# EAGLE design reflow_shield (EAGLE 5.06)
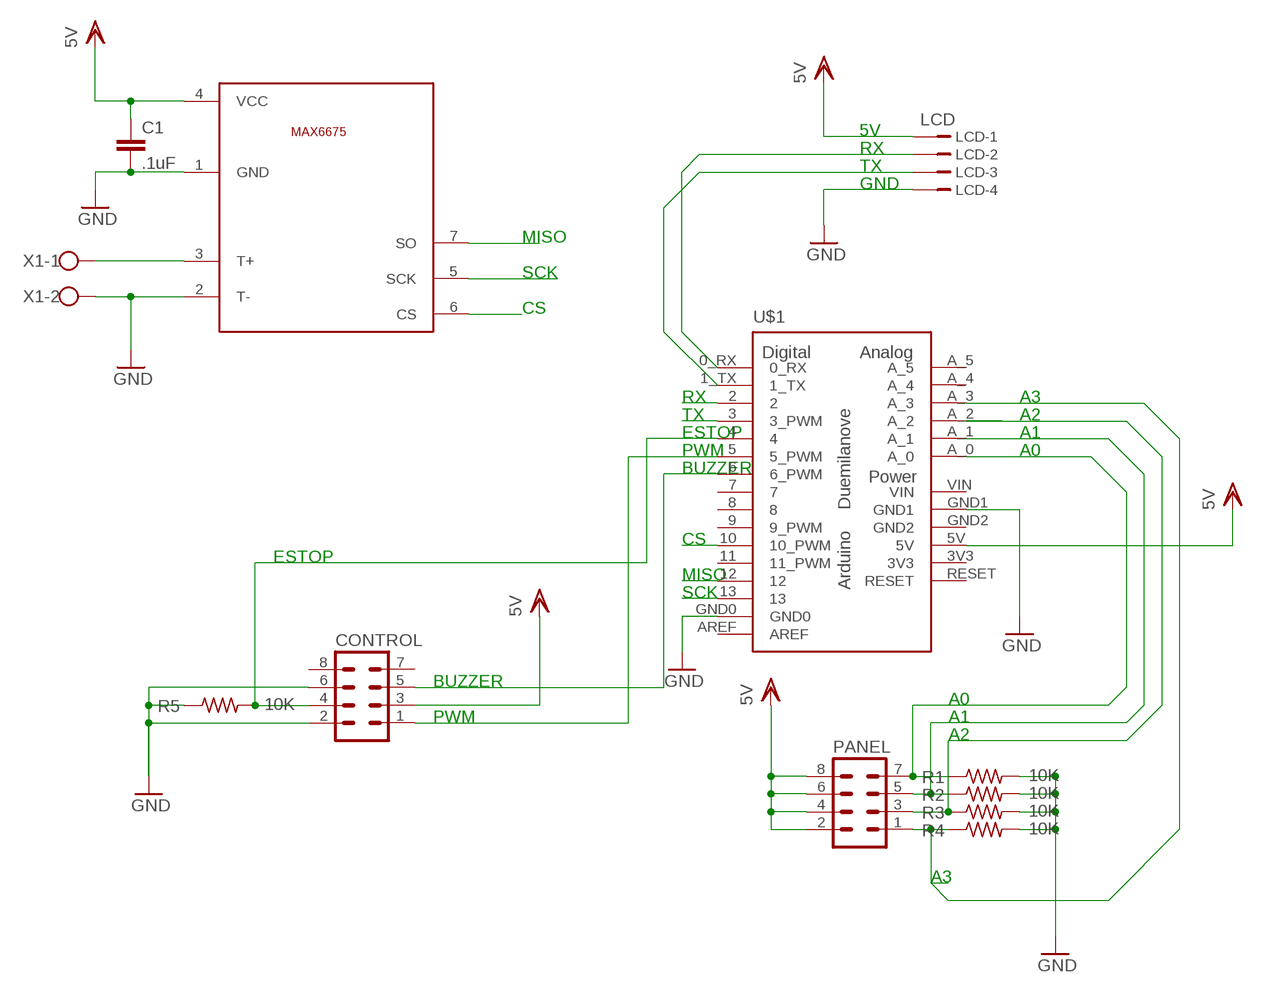
[diagram p0: schematic, sheet 1]

## Parts
C1  .1uF  C-EUC0805  [C0805]
CONTROL  MA04-2  [MA04-2]
LCD  LCD  B4B-ZR  [B4B-ZR]
PANEL  MA04-2  [MA04-2]
R1  10K  R-US_M0805  [M0805]
R2  10K  R-US_M0805  [M0805]
R3  10K  R-US_M0805  [M0805]
R4  10K  R-US_M0805  [M0805]
R5  10K  R-US_M0805  [M0805]
U$1  ARDUINO-USBLONG_PADS_TEXT  [SHIELD]
U$2  MAX6676ISA  [SO8]
X1  W237-102  [W237-102]

## Nets
A0: PANEL.7 R1.1 U$1.A_0
A1: PANEL.5 R2.1 U$1.A_1
A2: PANEL.3 R3.1 U$1.A_2
A3: PANEL.1 R4.1 U$1.A_3
BUZZER: CONTROL.5 U$1.6(6_PWM)
CS: U$1.10(10_PWM) U$2.6(CS)
ESTOP: CONTROL.4 R5.2 U$1.4
GND: C1.2 CONTROL.2 CONTROL.6 LCD.4 R1.2 R2.2 R3.2 R4.2 R5.1 U$1.GND0 U$2.1(GND) U$2.2(T-) X1.2
GND1: U$1.GND1 ; supply symbol labelled GND
MISO: U$1.12 U$2.7(SO)
N$3: U$2.3(T+) X1.1
PWM: CONTROL.1 U$1.5(5_PWM)
RX: LCD.2 U$1.0_RX U$1.2
SCK: U$1.13 U$2.5(SCK)
TX: LCD.3 U$1.1_TX U$1.3(3_PWM)
VDD: C1.1 CONTROL.3 LCD.1 PANEL.2 PANEL.4 PANEL.6 PANEL.8 U$1.5V U$2.4(VCC) ; supply symbol labelled 5V
Unconnected: CONTROL.7 CONTROL.8 U$1.7 U$1.8 U$1.9(9_PWM) U$1.11(11_PWM) U$1.A_4 U$1.A_5 U$1.AREF U$1.GND2 U$1.RESET

## Notes on the sheet
- 5V
- RX
- TX
- GND
- MISO
- SCK
- CS
- RX | A3
- TX | A2
- ESTOP | A1
- PWM | A0
- BUZZER
- CS
- ESTOP
- MISO
- SCK
- BUZZER
- A0
- PWM | A1
- A2
- A3

## Power pins joined to a net without a drawn wire
3V3: U$1.3V3
VIN: U$1.VIN

## Library data of the parts
C1 = rcl:C-EU: CAPACITOR, European symbol
CONTROL PANEL = con-lstb:MA04-2: PIN HEADER
LCD = con-jst:?4B-ZR: ZH CONNECTOR 1.5 mm, 4 pin 1 row Source: http://www.jst.com .. eZH.pdf
R1-R5 = rcl:R-US_: RESISTOR, American symbol
U$1 = Arduino-Various:ARDUINO-USB: The Ardiuno Duemilanove Pinouts layoutet as a Bare Shield. v0.5 Also for Arduino Diecimila. This is designed as a Part and has no Outline in the Dimension Layer. The Outline, when present, is drawed at the tPlace / bPlace Layer. Library by Stephanie Lange, http://www.k-ita.de/~sl/
U$2 = reflowparts:MAX6676ISA
X1 = con-wago-500:W237-102: WAGO SCREW CLAMP

## Board
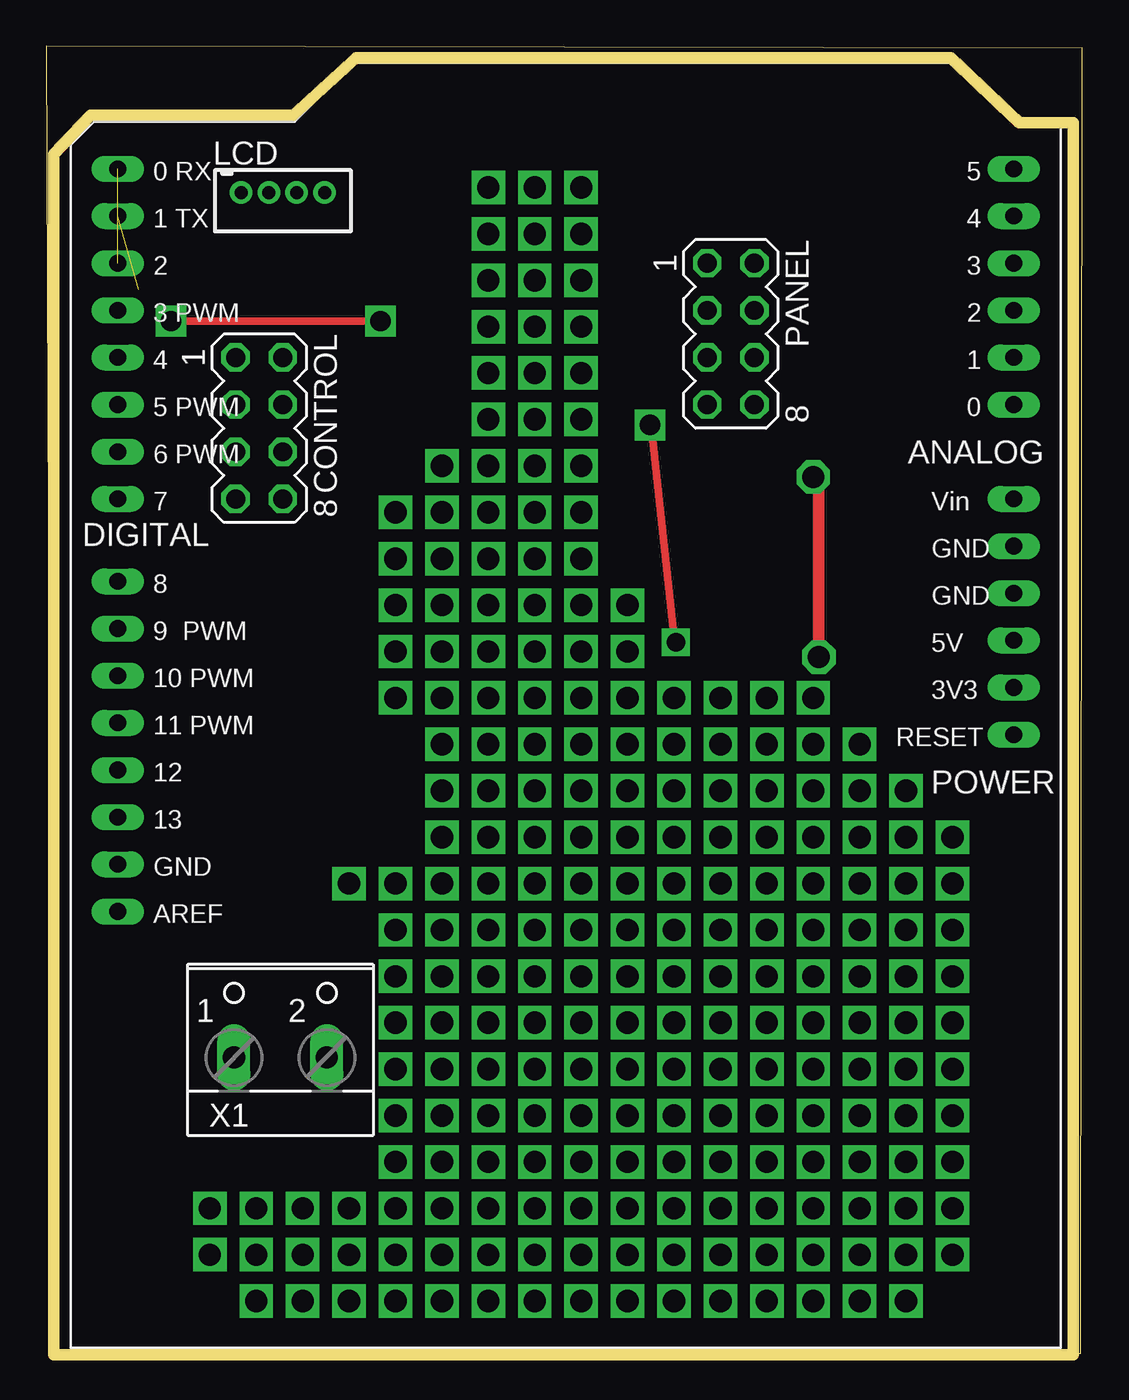
[diagram p1: board, top side]
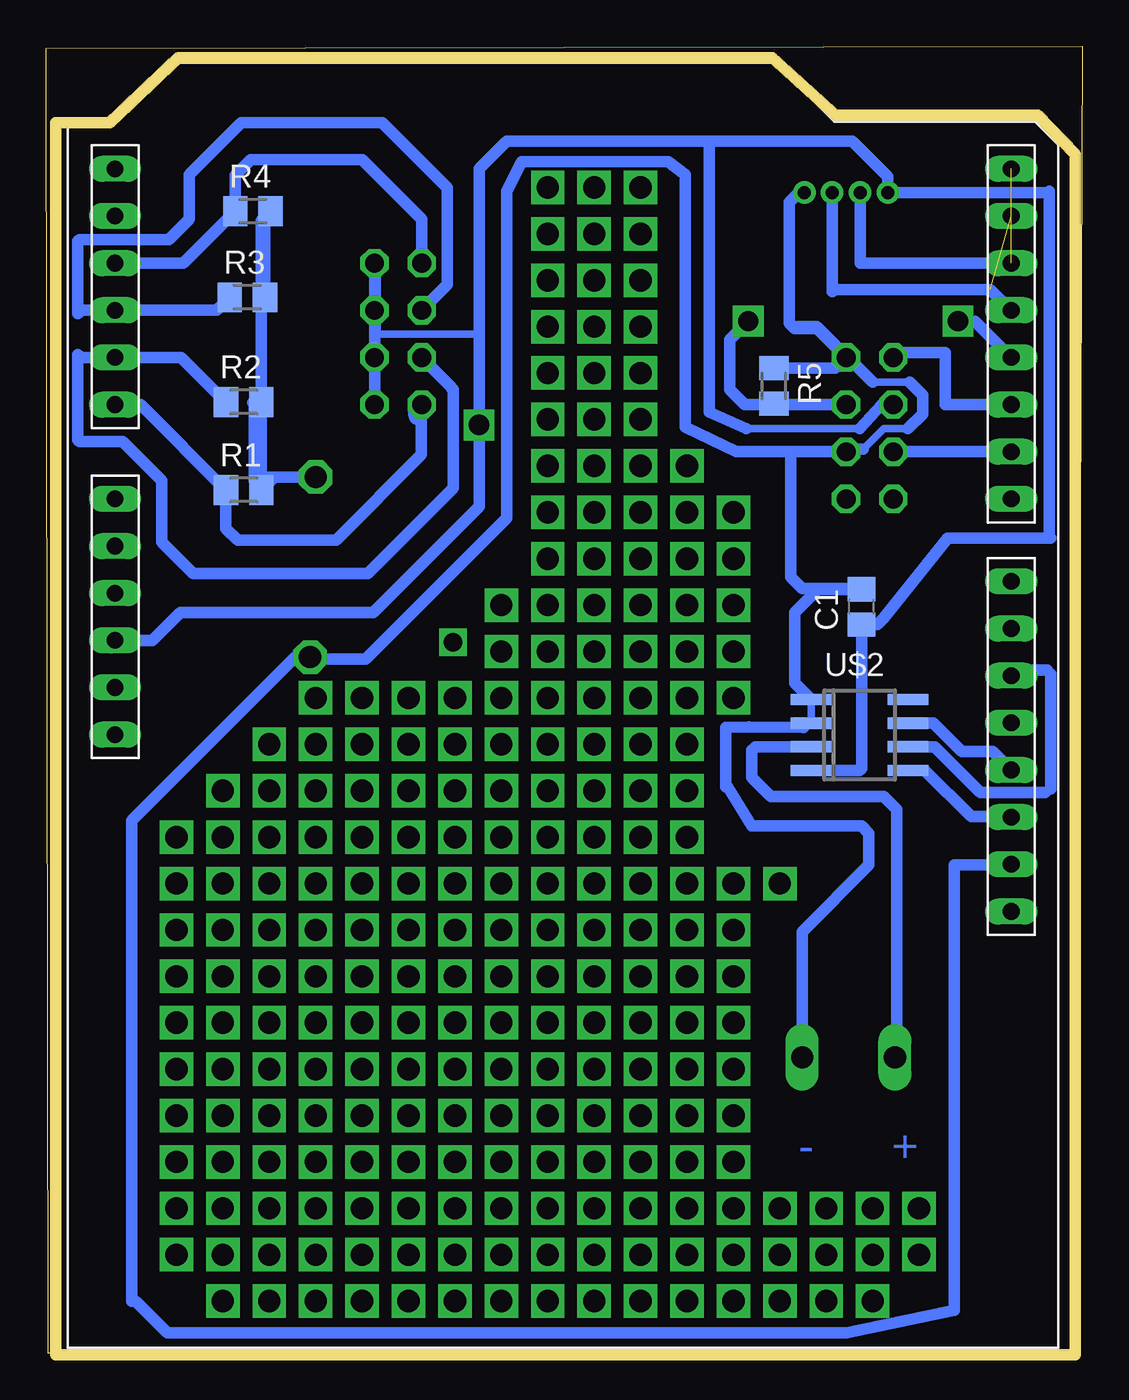
[diagram p2: board, bottom side, seen from below]

Size 55.8 x 70.4 mm. Coordinates in mm from the lower left corner, seen from the top.
Outline: 0.3,0 55.7,0 55.8,70.3 0,70.4 0.3,0
Copper layers (1*16): Top 0.035mm / dielectric 1.5mm / Bottom 0.035mm
Design rules "default": minimum track width 10mil, minimum drill 24mil, track to track 8mil, track to pad 8mil, pad to pad 8mil, via to via 8mil, smd to smd 8mil, copper to edge 40mil, drill to drill 8mil, minimum pad ring 10mil, minimum via ring 8mil, stop-mask expansion 4mil, vias tented up to drill 0mil, thermal gap 10mil
Milling: 9 lines

### Footprints (pad centres in the part's own frame; a part is rotated, then mirrored left to right if it is on the bottom)
C0805 = smd 1.3 x 1.5: 1 -0.95,0; 2 0.95,0
MA04-2 = drill 1.016 octagon: 1 -3.81,-1.27; 2 -3.81,1.27; 3 -1.27,-1.27; 4 -1.27,1.27; 5 1.27,-1.27; 6 1.27,1.27; 7 3.81,-1.27; 8 3.81,1.27
B4B-ZR = drill 0.7 pad 1.1 round: 1 -2.25,0; 2 -0.75,0; 3 0.75,0; 4 2.25,0
M0805 = smd 1.3 x 1.6: 1 -0.95,0; 2 0.95,0
SHIELD = drill 0.9 pad 1.27 long: 0_RX -25.4,27.94; 1_TX -25.4,25.4; 2 -25.4,22.86; 3 -25.4,20.32; 3V3 22.86,0; 4 -25.4,17.78; 5 -25.4,15.24; 5V 22.86,2.54; 6 -25.4,12.7; 7 -25.4,10.16; 8 -25.4,5.715; 9 -25.4,3.175; 10 -25.4,0.635; 11 -25.4,-1.905; 12 -25.4,-4.445; 13 -25.4,-6.985; A_0 22.86,15.24; A_1 22.86,17.78; A_2 22.86,20.32; A_3 22.86,22.86; A_4 22.86,25.4; A_5 22.86,27.94; AREF -25.4,-12.065; GND0 -25.4,-9.525; GND1 22.86,7.62; GND2 22.86,5.08; RESET 22.86,-2.54; VIN 22.86,10.16
SO8 = smd 0.6 x 2.2: 1 -1.905,-2.6; 2 -0.635,-2.6; 3 0.635,-2.6; 4 1.905,-2.6; 5 1.905,2.6; 6 0.635,2.6; 7 -0.635,2.6; 8 -1.905,2.6
W237-102 = drill 1.194 long: 1 -2.5,-1.27; 2 2.5,-1.27

### Placement (x,y rotation side)
C1  11.9,40.2 90 bottom
CONTROL  11.46,49.83 270 top
LCD  12.73,62.53 0 top
PANEL  36.86,54.91 270 top
R1  45.18,46.5 0 bottom
R2  45.18,51.24 0 bottom
R3  44.98,56.88 0 bottom
R4  44.68,61.52 0 bottom
R5  16.62,52.11 270 bottom
U$1  29.24,35.86 0 top
U$2  12,33.3 270 bottom
X1  12.6,17.2 0 top

### Tracks (layer width: path | path; a pad name or v marks a point on that pad's centre or on a via)
A0
  Bottom 0.61: U$1.A_0 50.73,51.1 R1.1 46.13,44.43 45.5,43.8 40.2,43.8 35.6,48.4 35.6,50.3 35.8,50.5
  Bottom 1.016: PANEL.7 35.8,51.1 35.8,50.5
A1
  Bottom 0.61: R2.1 48.53,53.64 U$1.A_1 53.94,53.64 54.1,53.8 54.1,49.2 54,49.1 51.7,49.1 49.6,47 49.6,43.7 47.9,42 38.5,42 33.9,46.6 33.9,51.9 34,52 34,52.05 PANEL.5
A2
  Bottom 0.61: R3.1 46.63,56.18 U$1.A_2 53.92,56.18 54.1,56 54.1,59.9 54,60 49.2,60 48.1,61.1 48.1,63.5 45.3,66.3 37.7,66.3 34.2,62.8 34.2,57.57 PANEL.3
A3
  Bottom 0.61: U$1.A_3 48.43,58.72 R4.1 45.63,63.47 44.8,64.3 38.8,64.3 35.59,61.09 PANEL.1
BUZZER
  Bottom 0.61: U$1.6 CONTROL.5
CS
  Bottom 0.406: 1.7,30.4 2,30.2 | 1.7,36.6 1.9,36.8
  Bottom 0.61: U$2.6 7.96,32.66 5.5,30.2 2,30.2 | 1.7,30.4 1.7,36.6 | 1.9,36.8 3.54,36.8 U$1.10
ESTOP  (via drill 1.1)
  Top 0.406: v6.7,55.6 v18,55.6
  Bottom 0.61: R5.2 17.14,51.16 17.2,51.1 CONTROL.4 18.2,51.1 19,51.9 19,54.6 v18,55.6 | v6.7,55.6 5.8,55.6 U$1.4
GND  (via drill 1.2 pad 1.27)
  Top 0.61: v41.3,47.2 41.6,46.9 v41.6,37.5
  Bottom 0.406: 9.3,52.3 11.3,52.3 | 9.4,49.8 10.7,49.8 11.8,48.7 | 14.6,35.3 U$2.1 U$2.2
  Bottom 0.61: R2.2 R1.2 43.53,47.2 | R2.2 44.23,60.9 | 44.23,60.9 44.23,61.02 R4.2 | U$1.GND0 3.88,26.3 6.9,26.3 6.9,2.3 12.7,1.1 49.3,1.1 51,2.8 51.2,2.8 51.2,28.7 42.4,37.5 v41.6,37.5 41.5,37.4 38.6,37.4 31,45 31,62.6 30.2,64.2 22.3,64.2 21.4,63.5 21.4,49.9 18.66,48.56 15.7,48.56 | v41.3,47.2 43.53,47.2 | R5.1 13.31,53.06 CONTROL.2 14.29,55.2 15.5,55.2 15.6,55.3 | LCD.4 15.27,62.53 15.8,62 15.8,55.5 15.6,55.3 | 15.7,48.56 CONTROL.6 12.59,48.7 11.8,48.7 | 15.6,55.3 14.3,55.3 11.3,52.3 | 9.3,52.3 8.6,51.6 8.6,50.6 9.4,49.8 | U$2.1 15.5,36.1 15.5,39.9 14.25,41.15 C1.2 11.95,41.2 15.1,41.2 15.7,41.8 15.7,48.56 | 43.53,47.2 44.4,47.2 44.6,47 44.6,51.1 44.7,51.2 44.27,51.2 R2.2 | R3.2 44.03,60.7 44.23,60.9 | U$2.2 15.4,33.93 15,33.7 17.96,33.73 19.2,33.7 19.2,30.5 19.1,30.5 17.8,28.4 11.9,28.4 11.5,28 11.5,26.3 15.1,22.7 X1.2
MISO
  Bottom 0.61: U$2.7 8.04,33.93 6.5,32.4 4.83,32.4 U$1.12
N$2  (via drill 1.2)
  other vias: 23.8,62.8
N$3
  Bottom 0.61: X1.1 10,16.03 10,29.3 10.7,30 16.8,30 17.8,31 17.8,32.5 17.64,32.66 U$2.3
N$61  (via drill 1.2)
  other vias: 26.3,62.8
N$76  (via drill 1.2)
  other vias: 28.8,62.8
N$77  (via drill 1.2)
  other vias: 28.8,60.3
N$85  (via drill 1.2)
  other vias: 26.3,60.3
N$86  (via drill 1.2)
  other vias: 23.8,60.3
N$93  (via drill 1.2)
  other vias: 23.8,57.8
N$94  (via drill 1.2)
  other vias: 26.3,57.8
N$102  (via drill 1.2)
  other vias: 28.8,57.8
N$103  (via drill 1.2)
  other vias: 28.8,55.3
N$113  (via drill 1.2)
  other vias: 26.3,55.3
N$114  (via drill 1.2)
  other vias: 23.8,55.3
N$125  (via drill 1.2)
  other vias: 23.8,52.8
N$126  (via drill 1.2)
  other vias: 26.3,52.8
N$147  (via drill 1.2)
  other vias: 28.8,52.8
N$148  (via drill 1.2)
  other vias: 28.8,50.3
N$149  (via drill 1.2)
  other vias: 26.3,50.3
N$150  (via drill 1.2)
  other vias: 23.8,50.3
N$175  (via drill 1.2)
  other vias: 28.8,47.8
N$176  (via drill 1.2)
  other vias: 26.3,47.8
N$193  (via drill 1.2)
  other vias: 23.8,47.8
N$194  (via drill 1.2)
  other vias: 21.3,47.8
N$207  (via drill 1.2)
  other vias: 28.8,45.3
N$208  (via drill 1.2)
  other vias: 26.3,45.3
N$225  (via drill 1.2)
  other vias: 23.8,45.3
N$226  (via drill 1.2)
  other vias: 21.3,45.3
N$239  (via drill 1.2)
  other vias: 18.8,45.3
N$240  (via drill 1.2)
  other vias: 28.8,42.8
N$255  (via drill 1.2)
  other vias: 26.3,42.8
N$256  (via drill 1.2)
  other vias: 23.8,42.8
N$273  (via drill 1.2)
  other vias: 21.3,42.8
N$274  (via drill 1.2)
  other vias: 18.8,42.8
N$287  (via drill 1.2)
  other vias: 18.8,40.3
N$288  (via drill 1.2)
  other vias: 21.3,40.3
N$305  (via drill 1.2)
  other vias: 23.8,40.3
N$306  (via drill 1.2)
  other vias: 26.3,40.3
N$319  (via drill 1.2)
  other vias: 28.8,40.3
N$320  (via drill 1.2)
  other vias: 18.8,37.8
N$336  (via drill 1.2)
  other vias: 21.3,37.8
N$337  (via drill 1.2)
  other vias: 23.8,37.8
N$344  (via drill 1.2)
  other vias: 26.3,37.8
N$345  (via drill 1.2)
  other vias: 28.8,37.8
N$346  (via drill 1.2)
  other vias: 18.8,35.3
N$347  (via drill 1.2)
  other vias: 21.3,35.3
N$348  (via drill 1.2)
  other vias: 23.8,35.3
N$349  (via drill 1.2)
  other vias: 26.3,35.3
N$350  (via drill 1.2)
  other vias: 28.8,35.3
N$351  (via drill 1.2)
  other vias: 31.3,35.3
N$352  (via drill 1.2)
  other vias: 33.8,35.3
N$353  (via drill 1.2)
  other vias: 36.3,35.3
N$354  (via drill 1.2)
  other vias: 38.8,35.3
N$355  (via drill 1.2)
  other vias: 41.3,35.3
N$356  (via drill 1.2)
  other vias: 31.3,37.8
N$357  (via drill 1.2)
  other vias: 31.3,40.3
N$358  (via drill 1.2)
  other vias: 21.3,32.8
N$359  (via drill 1.2)
  other vias: 23.8,32.8
N$360  (via drill 1.2)
  other vias: 26.3,32.8
N$361  (via drill 1.2)
  other vias: 31.3,32.8
N$362  (via drill 1.2)
  other vias: 28.8,32.8
N$363  (via drill 1.2)
  other vias: 33.8,32.8
N$364  (via drill 1.2)
  other vias: 36.3,32.8
N$365  (via drill 1.2)
  other vias: 38.8,32.8
N$366  (via drill 1.2)
  other vias: 41.3,32.8
N$367  (via drill 1.2)
  other vias: 43.8,32.8
N$368  (via drill 1.2)
  other vias: 21.3,30.3
N$369  (via drill 1.2)
  other vias: 23.8,30.3
N$370  (via drill 1.2)
  other vias: 26.3,30.3
N$371  (via drill 1.2)
  other vias: 28.8,30.3
N$372  (via drill 1.2)
  other vias: 31.3,30.3
N$373  (via drill 1.2)
  other vias: 36.3,30.3
N$374  (via drill 1.2)
  other vias: 33.8,30.3
N$375  (via drill 1.2)
  other vias: 38.8,30.3
N$376  (via drill 1.2)
  other vias: 41.3,30.3
N$377  (via drill 1.2)
  other vias: 43.8,30.3
N$378  (via drill 1.2)
  other vias: 46.3,30.3
N$379  (via drill 1.2)
  other vias: 21.3,27.8
N$380  (via drill 1.2)
  other vias: 23.8,27.8
N$381  (via drill 1.2)
  other vias: 26.3,27.8
N$382  (via drill 1.2)
  other vias: 28.8,27.8
N$383  (via drill 1.2)
  other vias: 31.3,27.8
N$384  (via drill 1.2)
  other vias: 33.8,27.8
N$385  (via drill 1.2)
  other vias: 36.3,27.8
N$386  (via drill 1.2)
  other vias: 41.3,27.8
N$387  (via drill 1.2)
  other vias: 38.8,27.8
N$388  (via drill 1.2)
  other vias: 43.8,27.8
N$389  (via drill 1.2)
  other vias: 46.3,27.8
N$390  (via drill 1.2)
  other vias: 48.8,27.8
N$391  (via drill 1.2)
  other vias: 16.3,25.3
N$392  (via drill 1.2)
  other vias: 18.8,25.3
N$393  (via drill 1.2)
  other vias: 21.3,25.3
N$394  (via drill 1.2)
  other vias: 23.8,25.3
N$395  (via drill 1.2)
  other vias: 26.3,25.3
N$396  (via drill 1.2)
  other vias: 28.8,25.3
N$397  (via drill 1.2)
  other vias: 31.3,25.3
N$398  (via drill 1.2)
  other vias: 33.8,25.3
N$399  (via drill 1.2)
  other vias: 36.3,25.3
N$400  (via drill 1.2)
  other vias: 38.8,25.3
N$401  (via drill 1.2)
  other vias: 41.3,25.3
N$402  (via drill 1.2)
  other vias: 43.8,25.3
N$403  (via drill 1.2)
  other vias: 46.3,25.3
N$404  (via drill 1.2)
  other vias: 48.8,25.3
N$405  (via drill 1.2)
  other vias: 18.8,22.8
N$406  (via drill 1.2)
  other vias: 21.3,22.8
N$407  (via drill 1.2)
  other vias: 23.8,22.8
N$408  (via drill 1.2)
  other vias: 26.3,22.8
N$409  (via drill 1.2)
  other vias: 28.8,22.8
N$410  (via drill 1.2)
  other vias: 31.3,22.8
N$411  (via drill 1.2)
  other vias: 33.8,22.8
N$412  (via drill 1.2)
  other vias: 36.3,22.8
N$413  (via drill 1.2)
  other vias: 38.8,22.8
N$414  (via drill 1.2)
  other vias: 41.3,22.8
N$415  (via drill 1.2)
  other vias: 43.8,22.8
N$416  (via drill 1.2)
  other vias: 46.3,22.8
N$417  (via drill 1.2)
  other vias: 48.8,22.8
N$418  (via drill 1.2)
  other vias: 48.8,20.3
N$419  (via drill 1.2)
  other vias: 48.8,17.8
N$420  (via drill 1.2)
  other vias: 48.8,15.3
N$421  (via drill 1.2)
  other vias: 48.8,12.8
N$422  (via drill 1.2)
  other vias: 48.8,10.3
N$423  (via drill 1.2)
  other vias: 48.8,7.8
N$424  (via drill 1.2)
  other vias: 48.8,5.3
N$425  (via drill 1.2)
  other vias: 46.3,2.8
N$426  (via drill 1.2)
  other vias: 46.3,5.3
N$427  (via drill 1.2)
  other vias: 46.3,7.8
N$428  (via drill 1.2)
  other vias: 46.3,10.3
N$429  (via drill 1.2)
  other vias: 46.3,12.8
N$430  (via drill 1.2)
  other vias: 46.3,15.3
N$431  (via drill 1.2)
  other vias: 46.3,17.8
N$432  (via drill 1.2)
  other vias: 46.3,20.3
N$433  (via drill 1.2)
  other vias: 43.8,20.3
N$434  (via drill 1.2)
  other vias: 43.8,17.8
N$435  (via drill 1.2)
  other vias: 43.8,15.3
N$436  (via drill 1.2)
  other vias: 43.8,12.8
N$437  (via drill 1.2)
  other vias: 43.8,10.3
N$438  (via drill 1.2)
  other vias: 43.8,7.8
N$439  (via drill 1.2)
  other vias: 43.8,5.3
N$440  (via drill 1.2)
  other vias: 43.8,2.8
N$441  (via drill 1.2)
  other vias: 41.3,2.8
N$442  (via drill 1.2)
  other vias: 41.3,5.3
N$443  (via drill 1.2)
  other vias: 41.3,7.8
N$444  (via drill 1.2)
  other vias: 41.3,10.3
N$445  (via drill 1.2)
  other vias: 41.3,12.8
N$446  (via drill 1.2)
  other vias: 41.3,15.3
N$447  (via drill 1.2)
  other vias: 41.3,20.3
N$448  (via drill 1.2)
  other vias: 41.3,17.8
N$449  (via drill 1.2)
  other vias: 38.8,20.3
N$450  (via drill 1.2)
  other vias: 38.8,17.8
N$451  (via drill 1.2)
  other vias: 38.8,12.8
N$452  (via drill 1.2)
  other vias: 38.8,15.3
N$453  (via drill 1.2)
  other vias: 38.8,10.3
N$454  (via drill 1.2)
  other vias: 36.3,5.3
N$455  (via drill 1.2)
  other vias: 38.8,7.8
N$456  (via drill 1.2)
  other vias: 38.8,5.3
N$457  (via drill 1.2)
  other vias: 38.8,2.8
N$458  (via drill 1.2)
  other vias: 36.3,2.8
N$459  (via drill 1.2)
  other vias: 36.3,7.8
N$460  (via drill 1.2)
  other vias: 36.3,10.3
N$461  (via drill 1.2)
  other vias: 36.3,15.3
N$462  (via drill 1.2)
  other vias: 36.3,12.8
N$463  (via drill 1.2)
  other vias: 36.3,17.8
N$464  (via drill 1.2)
  other vias: 36.3,20.3
N$465  (via drill 1.2)
  other vias: 33.8,20.3
N$466  (via drill 1.2)
  other vias: 31.3,20.3
N$467  (via drill 1.2)
  other vias: 28.8,20.3
N$468  (via drill 1.2)
  other vias: 26.3,20.3
N$469  (via drill 1.2)
  other vias: 23.8,20.3
N$470  (via drill 1.2)
  other vias: 21.3,20.3
N$471  (via drill 1.2)
  other vias: 18.8,20.3
N$472  (via drill 1.2)
  other vias: 18.8,17.8
N$473  (via drill 1.2)
  other vias: 21.3,17.8
N$474  (via drill 1.2)
  other vias: 23.8,17.8
N$475  (via drill 1.2)
  other vias: 26.3,17.8
N$476  (via drill 1.2)
  other vias: 28.8,17.8
N$477  (via drill 1.2)
  other vias: 31.3,17.8
N$478  (via drill 1.2)
  other vias: 33.8,17.8
N$479  (via drill 1.2)
  other vias: 33.8,15.3
N$480  (via drill 1.2)
  other vias: 31.3,15.3
N$481  (via drill 1.2)
  other vias: 26.3,15.3
N$482  (via drill 1.2)
  other vias: 28.8,15.3
N$483  (via drill 1.2)
  other vias: 23.8,15.3
N$484  (via drill 1.2)
  other vias: 21.3,15.3
N$485  (via drill 1.2)
  other vias: 18.8,15.3
N$486  (via drill 1.2)
  other vias: 18.8,12.8
N$487  (via drill 1.2)
  other vias: 21.3,12.8
N$488  (via drill 1.2)
  other vias: 23.8,12.8
N$489  (via drill 1.2)
  other vias: 26.3,12.8
N$490  (via drill 1.2)
  other vias: 28.8,12.8
N$491  (via drill 1.2)
  other vias: 33.8,12.8
N$492  (via drill 1.2)
  other vias: 31.3,12.8
N$493  (via drill 1.2)
  other vias: 33.8,10.3
N$494  (via drill 1.2)
  other vias: 31.3,10.3
N$495  (via drill 1.2)
  other vias: 28.8,7.8
N$496  (via drill 1.2)
  other vias: 28.8,10.3
N$497  (via drill 1.2)
  other vias: 26.3,10.3
N$498  (via drill 1.2)
  other vias: 23.8,10.3
N$499  (via drill 1.2)
  other vias: 21.3,10.3
N$500  (via drill 1.2)
  other vias: 18.8,10.3
N$501  (via drill 1.2)
  other vias: 18.8,7.8
N$502  (via drill 1.2)
  other vias: 16.3,7.8
N$503  (via drill 1.2)
  other vias: 11.3,7.8
N$504  (via drill 1.2)
  other vias: 13.8,7.8
N$505  (via drill 1.2)
  other vias: 8.8,7.8
N$506  (via drill 1.2)
  other vias: 8.8,5.3
N$507  (via drill 1.2)
  other vias: 11.3,2.8
N$508  (via drill 1.2)
  other vias: 11.3,5.3
N$509  (via drill 1.2)
  other vias: 16.3,5.3
N$510  (via drill 1.2)
  other vias: 13.8,5.3
N$511  (via drill 1.2)
  other vias: 13.8,2.8
N$512  (via drill 1.2)
  other vias: 16.3,2.8
N$513  (via drill 1.2)
  other vias: 18.8,2.8
N$514  (via drill 1.2)
  other vias: 18.8,5.3
N$515  (via drill 1.2)
  other vias: 21.3,5.3
N$516  (via drill 1.2)
  other vias: 21.3,7.8
N$517  (via drill 1.2)
  other vias: 21.3,2.8
N$518  (via drill 1.2)
  other vias: 23.8,2.8
N$519  (via drill 1.2)
  other vias: 23.8,5.3
N$520  (via drill 1.2)
  other vias: 23.8,7.8
N$521  (via drill 1.2)
  other vias: 26.3,7.8
N$522  (via drill 1.2)
  other vias: 26.3,5.3
N$523  (via drill 1.2)
  other vias: 26.3,2.8
N$524  (via drill 1.2)
  other vias: 28.8,2.8
N$525  (via drill 1.2)
  other vias: 28.8,5.3
N$526  (via drill 1.2)
  other vias: 33.8,7.8
N$527  (via drill 1.2)
  other vias: 31.3,7.8
N$528  (via drill 1.2)
  other vias: 31.3,5.3
N$529  (via drill 1.2)
  other vias: 33.8,5.3
N$530  (via drill 1.2)
  other vias: 33.8,2.8
N$531  (via drill 1.2)
  other vias: 31.3,2.8
PWM
  Bottom 0.61: U$1.5 7.4,51.1 7.4,53.9 10.19,53.9
  Bottom 1.016: 10.19,53.9 CONTROL.1
RX  (1 unrouted)
  Bottom 0.61: U$1.2 11.98,58.72 LCD.2
SCK
  Bottom 0.61: U$2.5 8.5,31.39 6,28.9 3.87,28.9 U$1.13
TX  (1 unrouted)
  Bottom 0.61: U$1.3 4.96,57.3 13.3,57.3 13.48,57.18 LCD.3
VDD  (via drill 1, 1.1)
  Top 0.406: v32.5,50 32.6,49.7 33.8,38.5
  Top 0.61: 33.8,38.5 33.9,38.5 v33.9,38.3
  Bottom 0.406: 18.1,49.8 12,49.8 | 32.5,54.9 38.1,54.9
  Bottom 0.61: 20.1,65.3 12.4,65.3 10.48,63.38 LCD.1 1.87,62.53 1.8,62.6 1.8,44 1.7,43.9 7.25,43.9 10.7,39.6 11.05,39.25 C1.1 11.9,31.5 12,31.4 U$2.4 | 20.1,65.3 31,65.3 32.5,63.8 32.5,55.3 | 32.5,55.3 32.5,45.8 | 32.5,45.8 32.5,45.6 38.2,39.9 48.6,39.9 50.1,38.4 51.9,38.4 52.3,38 52.3,38.2 U$1.5V | 10.1,51.1 CONTROL.3 10.8,51.1 12,49.8 | 18.1,49.8 20.1,50.7 20.1,65.3 | PANEL.8 38.1,51.07 38.1,50.8 38.13,50.83 PANEL.6 PANEL.4 PANEL.2 38.1,58.72 38.1,54.9 | 32.5,55.3 32.5,54.9 | 32.5,45.8 v32.5,50

### Text on the board
Bottom: + | -